# EAGLE design YMFC (EAGLE 9.5.2)
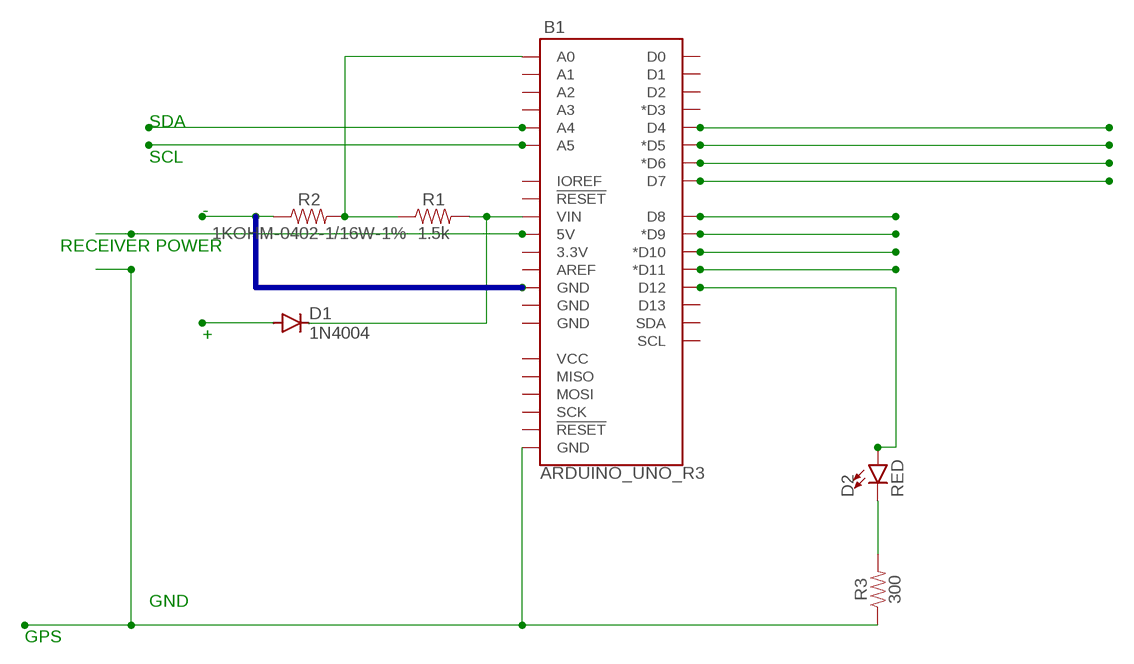
[diagram p0: schematic, sheet 1]

## Parts
B1  ARDUINO_UNO_R3  [ARDUINO_R3]
D1  1N4004  [DO41-10]
D2  RED  LED-RED0603  [LED-0603]
R1  1.5k  1.5KOHM-0603-1/10W-1%  [0603]
R2  1KOHM-0402-1/16W-1%  [0402]
R3  300  300OHM-0603-1/10W-1%  [0603]

## Nets
N$1: B1.VIN D1.C R1.2
N$2: B1.A0 R1.1 R2.2
N$3: D1.A
N$4: R2.1
N$5: B1.GND@4(GND)
N$6: B1.D8
N$7: B1.D9(*D9)
N$8: B1.D10(*D10)
N$9: B1.D11(*D11)
N$10: B1.D4
N$11: B1.D5(*D5)
N$12: B1.D6(*D6)
N$13: B1.D7
N$14: B1.D12 D2.A
N$16: D2.C R3.2
N$17: B1.GND@1(GND) R3.1
N$18: B1.5V
N$19: B1.A4
N$20: B1.A5
Unconnected: B1.3.3V B1.A1 B1.A2 B1.A3 B1.AREF B1.D0 B1.D1 B1.D2 B1.D3(*D3) B1.D13 B1.GND@2(GND) B1.GND@3(GND) B1.IOREF B1.MISO B1.MOSI B1.RESET@1(!RESET!) B1.RESET@2(!RESET!) B1.SCK B1.SCL B1.SDA B1.VCC

## Buses
B$1

## Notes on the sheet
- SDA
- SCL
- -
- RECEIVER POWER
- +
- GND
- GPS

## Library data of the parts
B1 = SparkFun-Boards:ARDUINO_UNO_R3: Arduino R3 Footprint with SPI header Arduino Uno R3 Compatible Footprint. Matches PCB size of the original board. SparkFun Products: SAMD21 Dev Breakout <https://www.sparkfun.com/products/13672> RedBoard <https://www.sparkfun.com/products/12757> R3 Stackable Headers <https://www.sparkfun.com/products/11417>
D1 = diode:1N4004: DIODE general purpose rectifier, 1 A
D2 = SparkFun-LED:LED-RED: Red SMD LED Used in manufacturing of most products at SparkFun Packages: 0603 - SMD 0603 package [Product Link] <http://docs.avagotech.com/docs/AV02-0551EN> 0603 SMART - SMD 0603 SMART package ( more efficient and expensive)[Product Link] <http://www.osram-os.com/Graphics/XPic2/00077099_0.pdf> 1206 - SMD1206 package [Product Link] <https://www.sparkfun.com/datasheets/DevTools/LilyPad/Q150OVS4.pdff> SparkFun Products: Pro Mini 328 -5V <https://www.sparkfun.com/products/821> RedBoard <https://www.sparkfun.com/products/12757> IOIO-OTG <https://www.sparkfun.com/products/13613>; PROD_ID: DIO-00819
R1 = SparkFun-Resistors:1.5KOHM: 1.5kΩ resistor A resistor is a passive two-terminal electrical component that implements electrical resistance as a circuit element. Resistors act to reduce current flow, and, at the same time, act to lower voltage levels within circuits. - Wikipedia; PROD_ID: RES-08306
R2 = SparkFun-Resistors:1KOHM: 1kΩ resistor A resistor is a passive two-terminal electrical component that implements electrical resistance as a circuit element. Resistors act to reduce current flow, and, at the same time, act to lower voltage levels within circuits. - Wikipedia; PROD_ID: RES-14342
R3 = SparkFun-Resistors:300OHM: 300Ω resistor A resistor is a passive two-terminal electrical component that implements electrical resistance as a circuit element. Resistors act to reduce current flow, and, at the same time, act to lower voltage levels within circuits. - Wikipedia; PROD_ID: RES-10328

## Board
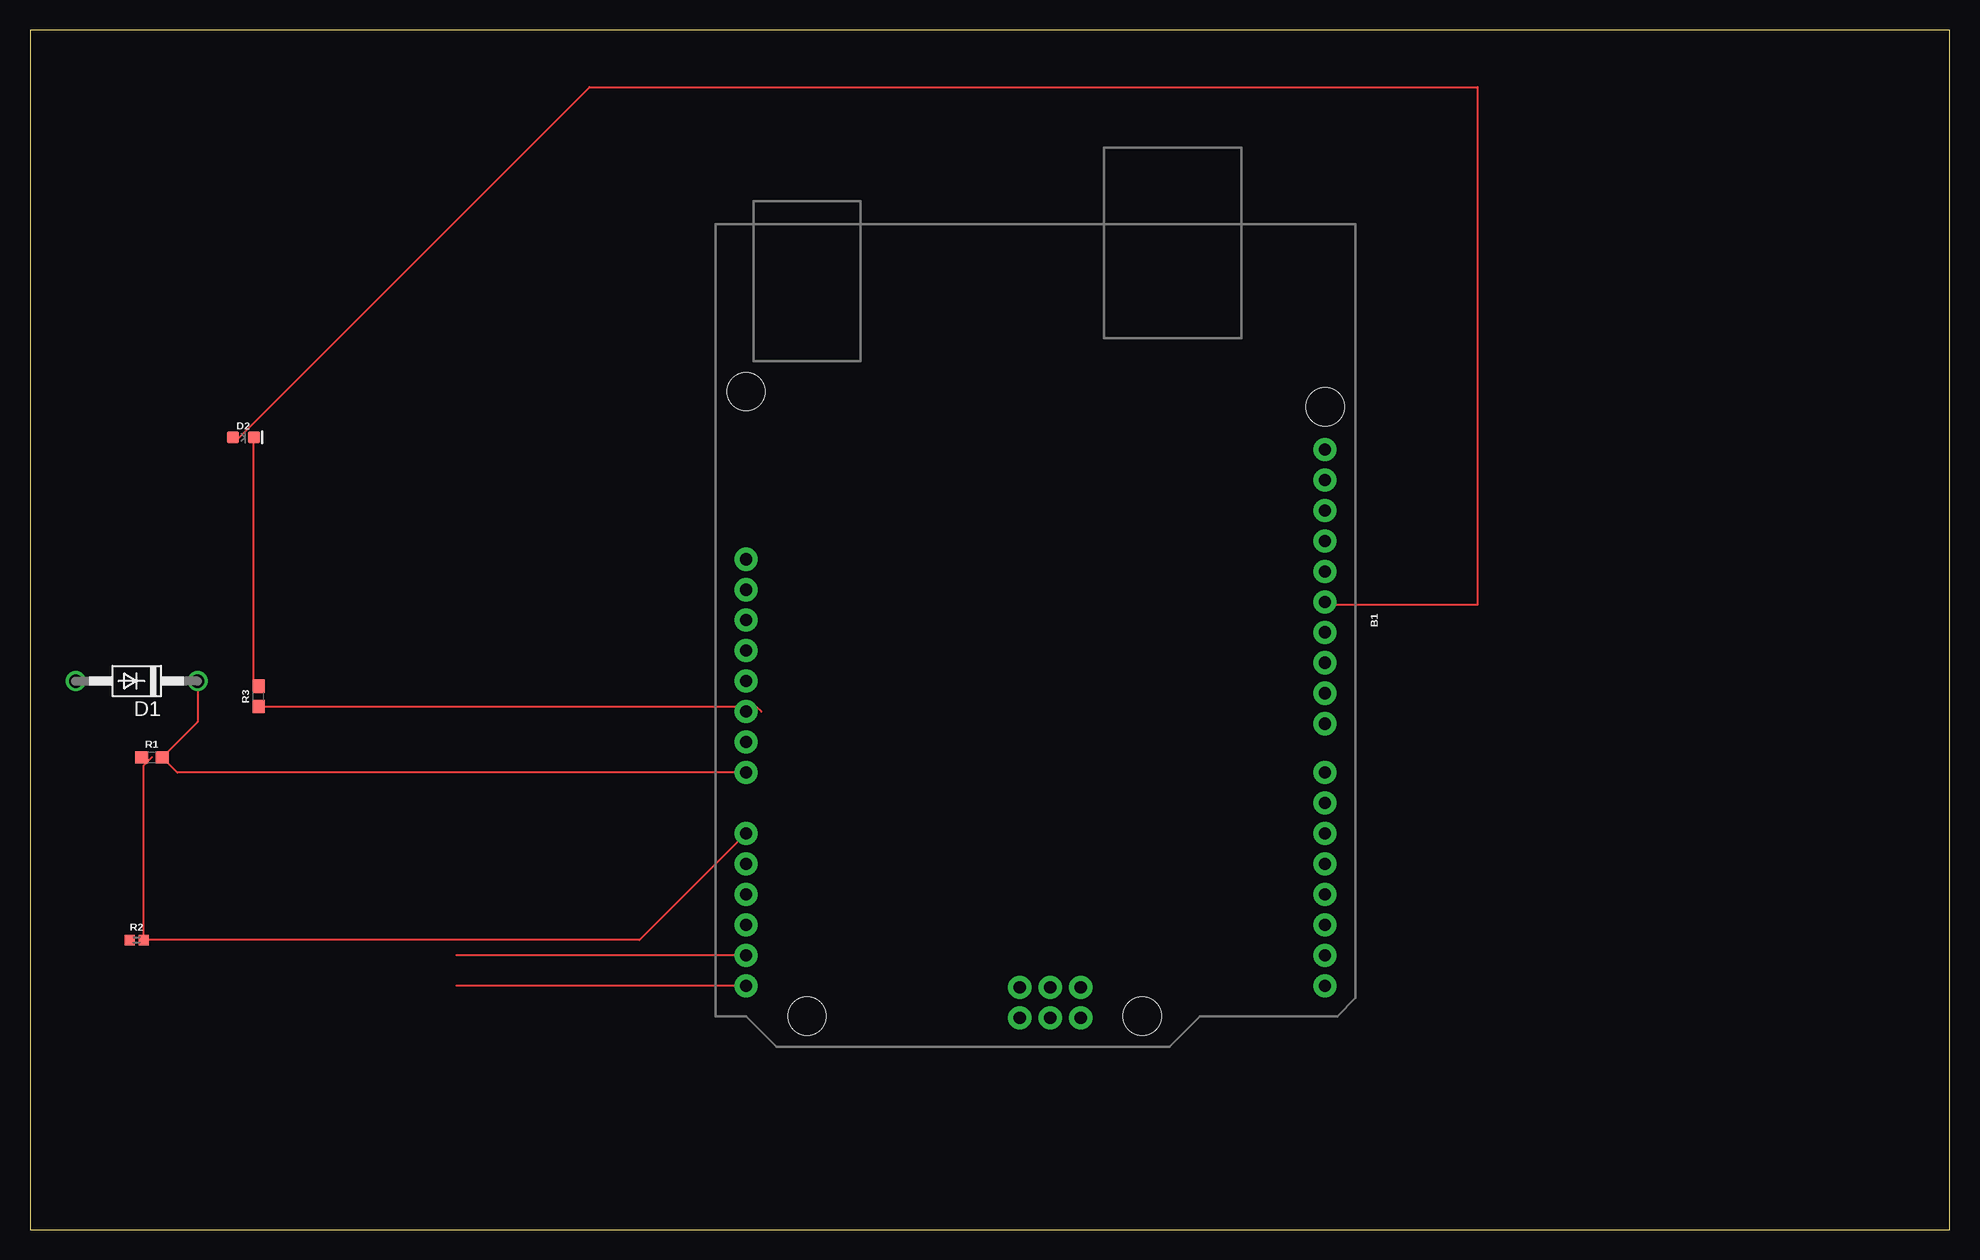
[diagram p1: board, top side]

Size 160 x 100 mm. Coordinates in mm from the lower left corner, seen from the top.
Outline: 0,0 160,0 160,100 0,100 0,0
Copper layers (1*16): Top 0.035mm / dielectric 1.5mm / Bottom 0.035mm
Design rules "default": minimum track width 6mil, minimum drill 0.35mm, track to track 6mil, track to pad 6mil, pad to pad 6mil, via to via 6mil, smd to smd 6mil, copper to edge 40mil, drill to drill 6mil, minimum pad ring 10mil, minimum via ring 8mil, stop-mask expansion 4mil, vias tented up to drill 0mil, thermal gap 10mil

### Footprints (pad centres in the part's own frame; a part is rotated, then mirrored left to right if it is on the bottom)
ARDUINO_R3 = drill 1.016 pad 1.93: 3.3V 2.54,-24.13; 5V 5.08,-24.13; A0 17.78,-24.13; A1 20.32,-24.13; A2 22.86,-24.13; A3 25.4,-24.13; A4 27.94,-24.13; A5 30.48,-24.13; AREF -9.144,24.13; D0 30.48,24.13; D1 27.94,24.13; D2 25.4,24.13; D3 22.86,24.13; D4 20.32,24.13; D5 17.78,24.13; D6 15.24,24.13; D7 12.7,24.13; D8 8.636,24.13; D9 6.096,24.13; D10 3.556,24.13; D11 1.016,24.13; D12 -1.524,24.13; D13 -4.064,24.13; GND@1 7.62,-24.13; GND@2 10.16,-24.13; GND@3 -6.604,24.13; GND@4 33.16,-1.32; IOREF -2.54,-24.13; MISO 30.62,3.76; MOSI 33.16,1.22; NC -5.08,-24.13; RESET@1 0,-24.13; RESET@2 30.62,-1.32; SCK 30.62,1.22; SCL -14.224,24.13; SDA -11.684,24.13; VCC 33.16,3.76; VIN 12.7,-24.13 | hole 3.175: -17.78,24.13; 33.02,8.89; 33.02,-19.05; -19.05,-24.13
DO41-10 = drill 1.118: A 5.08,0; C -5.08,0
LED-0603 = smd 1 x 1: A -0.877,0; C 0.877,0
0603 = smd 1.1 x 1: 1 -0.85,0; 2 0.85,0
0402 = smd 0.85 x 0.9: 1 -0.58,0; 2 0.58,0

### Placement (x,y rotation side)
B1  83.82,50.8 270 top
D1  8.89,45.72 180 top
D2  17.78,66.04 0 top
R1  10.16,39.37 0 top
R2  8.89,24.13 0 top
R3  19.05,44.45 90 top

### Tracks (layer width: path | path; a pad name or v marks a point on that pad's centre or on a via)
N$1
  Top 0.152: B1.VIN 12.28,38.1 R1.2 13.97,42.33 D1.C
N$2
  Top 0.152: B1.A0 50.8,24.13 R2.2 9.47,38.68 10.16,39.37
N$14
  Top 0.152: D2.A 17.42,66.04 46.63,95.25 120.65,95.25 120.65,52.07 107.95,52.07
N$16
  Top 0.152: R3.2 18.66,45.69 D2.C
N$17
  Top 0.152: R3.1 60.54,43.6 60.96,43.18
N$19
  Top 0.152: B1.A4 35.56,22.86
N$20
  Top 0.152: B1.A5 35.56,20.32